# EAGLE design schema (EAGLE 6.5.0)
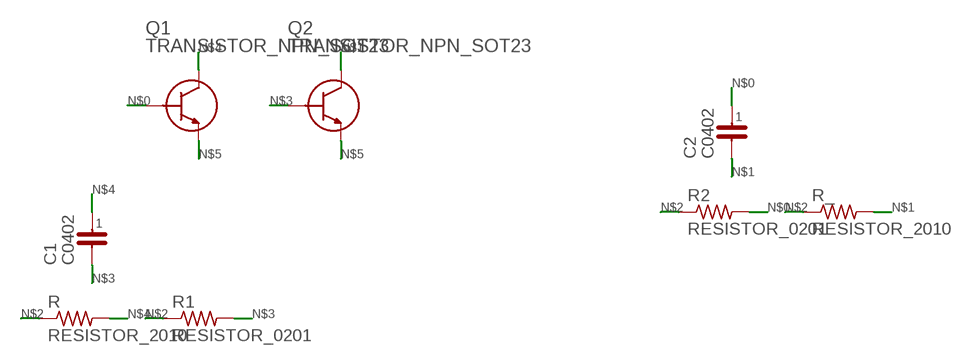
[diagram p0: schematic, sheet 1]

## Parts
C1  C0402  [C0402]
C2  C0402  [C0402]
Q1  TRANSISTOR_NPN_SOT23  [SOT23]
Q2  TRANSISTOR_NPN_SOT23  [SOT23]
R  RESISTOR_2010  [R_2010]
R1  RESISTOR_0201  [R_0201]
R2  RESISTOR_0201  [R_0201]
R_  RESISTOR_2010  [R_2010]

## Nets
N$0: C2.1 Q1.B R2.P$2
N$1: C2.2 Q2.C R_.P$2
N$2: R1.P$1 R2.P$1 R.P$1 R_.P$1
N$3: C1.2 Q2.B R1.P$2
N$4: C1.1 Q1.C R.P$2
N$5: Q1.E Q2.E

## Library data of the parts
C1 C2 = chipCapacitors:C0402
Q1 Q2 = juneSpreadsheetParts:TRANSISTOR_NPN_SOT23
R R_ = chipResistors:RESISTOR_2010
R1 R2 = chipResistors:RESISTOR_0201

## Board
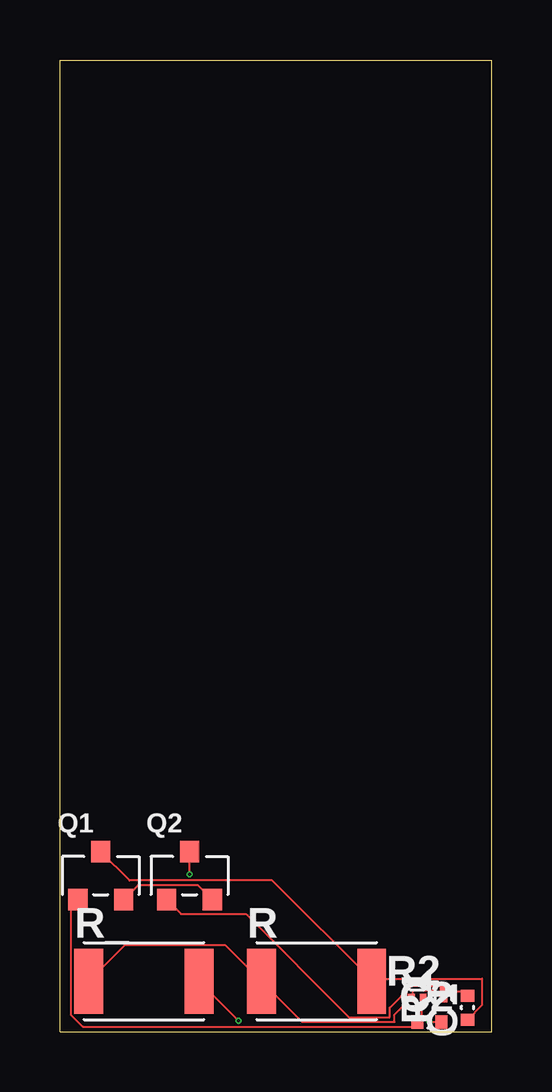
[diagram p1: board, top side]
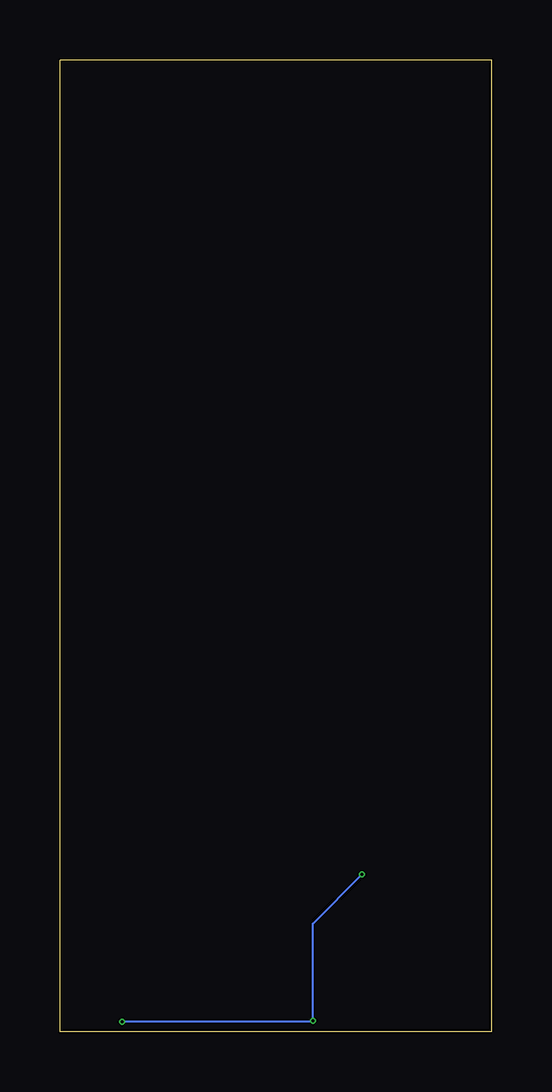
[diagram p2: board, bottom side, seen from below]

Size 18 x 40.5 mm. Coordinates in mm from the lower left corner, seen from the top.
Outline: 0,0 18,0 18,40.5 0,40.5 0,0
Copper layers (1*16): Top 0.035mm / dielectric 0.75mm / Bottom 0.035mm
Design rules "default": minimum track width 3mil, minimum drill 5mil, track to track 3mil, track to pad 3mil, pad to pad 3mil, via to via 3mil, smd to smd 0mil, copper to edge 5mil, drill to drill 8mil, minimum pad ring 5mil, minimum via ring 2.5mil, stop-mask expansion 4mil, vias tented up to drill 0mil, thermal gap 10mil

### Footprints (pad centres in the part's own frame; a part is rotated, then mirrored left to right if it is on the bottom)
C0402 = smd 0.5 x 0.55: 1 -0.5,0; 2 0.5,0
SOT23 = smd 0.8 x 0.9: B -0.95,-1; C 0,1; E 0.95,-1
R_2010 = smd 1.2 x 2.7: P$1 -2.3,0; P$2 2.3,0
R_0201 = smd 0.28 x 0.33: P$1 -0.24,0; P$2 0.24,0

### Placement (x,y rotation side)
C1  17,1 90 top
C2  15.4,0.4 0 top
Q1  1.7,6.5 0 top
Q2  5.4,6.5 0 top
R  10.7,2.1 0 top
R1  16,1.6 90 top
R2  14.9,1.4 0 top
R_  3.5,2.1 0 top

### Tracks (layer width: path | path; a pad name or v marks a point on that pad's centre or on a via)
N$0
  Top 0.076: R2.P$2 15.1,1.4 15.1,0.4 C2.1 14.7,0.2 0.95,0.2 0.45,0.7 0.45,5.5 Q1.B
N$1  (via drill 0.13)
  Top 0.076: v15.4,0.4 C2.2 | R_.P$2 v7.45,0.45 | v5.4,6.55 Q2.C
  Bottom 0.076: v15.4,0.4 7.45,0.4 v7.45,0.45 7.45,4.5 v5.4,6.55
N$2
  Top 0.076: R1.P$1 16,1.4 15.95,1.4 15.65,1.7 14.7,1.7 14.7,1.4 R2.P$1 13.95,0.7 13.95,0.4 10.1,0.4 R.P$1 6.9,3.6 2.7,3.6 R_.P$1
N$3
  Top 0.076: C1.2 16.85,1.65 16.15,1.65 16,1.8 R1.P$2 15.95,1.9 14.65,1.9 13.75,1 13.75,0.6 12.05,0.6 7.75,4.9 5.05,4.9 Q2.B
N$4
  Top 0.076: C1.1 17.6,1.1 17.6,2.2 13.1,2.2 R.P$2 13,2.15 8.85,6.3 2.9,6.3 Q1.C
N$5
  Top 0.076: Q1.E 3.25,6.1 5.75,6.1 Q2.E